# Altium schematic sheet Supply.SchDoc
size A4
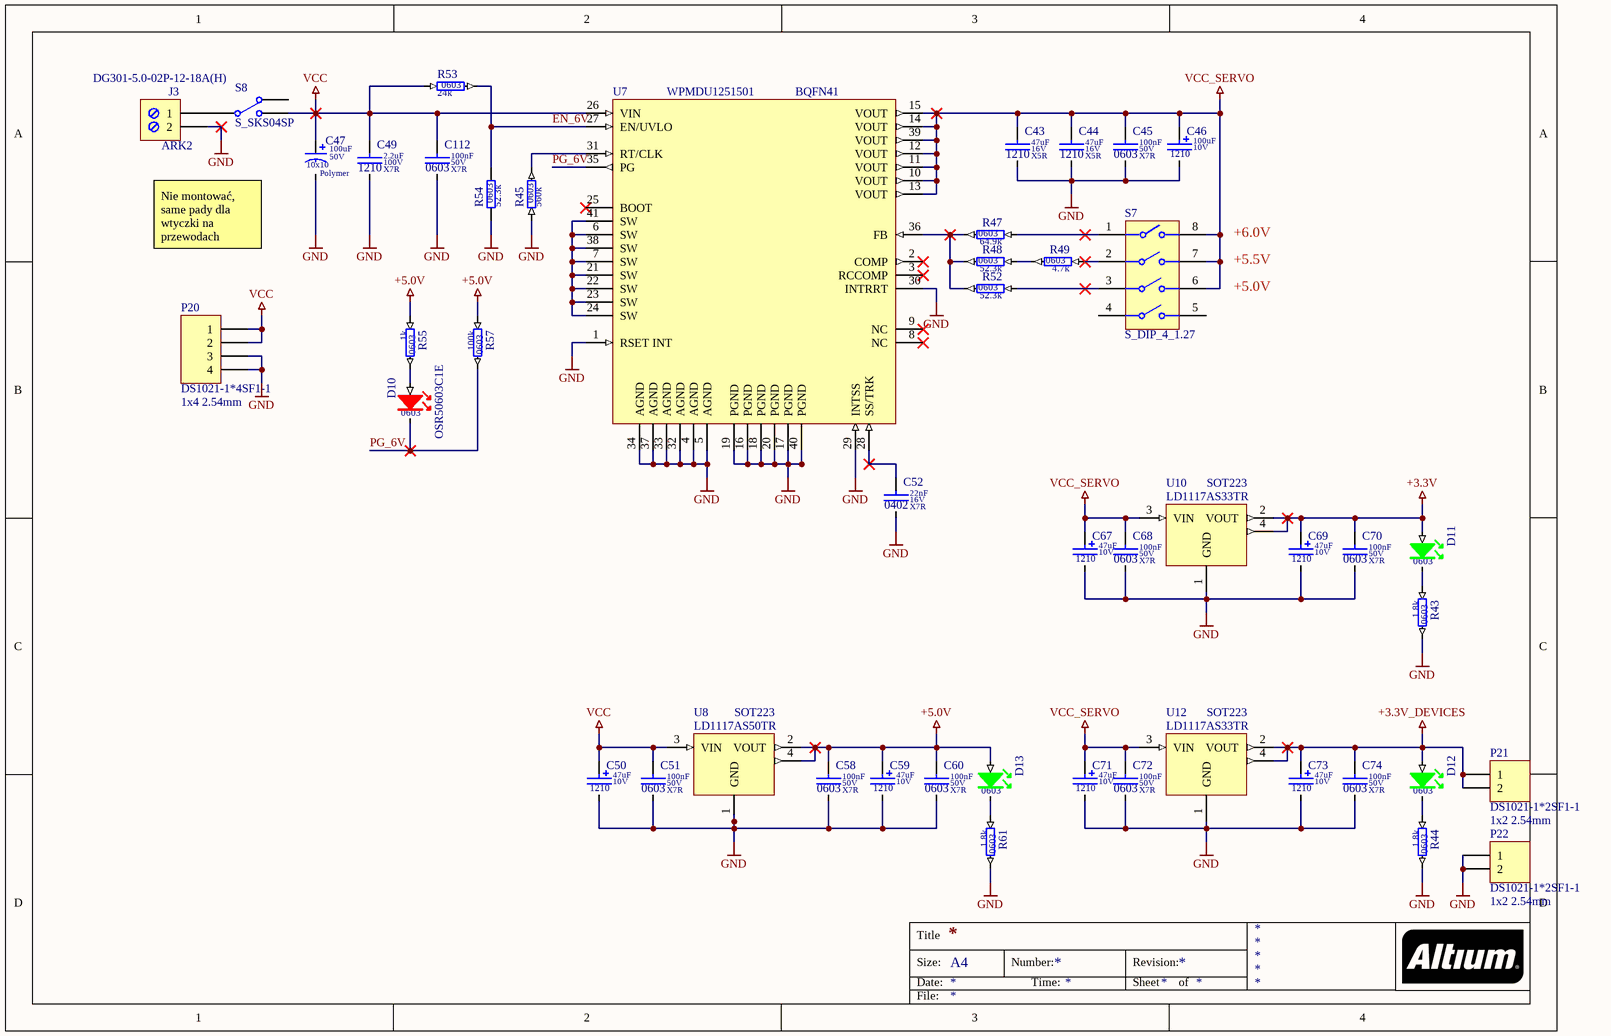
[diagram p0: Supply.SchDoc]

## Parts
C43  value 47uF  Dielectric: X5R  Voltage: 16V  SCH_Footprint: 1210  [C_1210_3225]  (hidden comment: Ceramic X5R)
C44  value 47uF  Dielectric: X5R  Voltage: 16V  SCH_Footprint: 1210  [C_1210_3225]  (hidden comment: Ceramic X5R)
C45  value 100nF  Dielectric: X7R  Voltage: 50V  SCH_Footprint: 0603  [C_0603_1608]  (hidden comment: Ceramic X7R)
C46  value 100uF  SCH_Footprint: 1210  Voltage: 10V  [CT_1210_3225]  (hidden comment: Tantalum Capacitor)
C47  value 100uF  Dielectric: Polymer  SCH_Footprint: 10x10  Voltage: 50V  [CE_D_10x10MM]  (hidden comment: Electrolytic Capacitor)
C49  value 2.2uF  Dielectric: X7R  Voltage: 100V  SCH_Footprint: 1210  [C_1210_3225]  (hidden comment: Ceramic X7R)
C50  value 47uF  SCH_Footprint: 1210  Voltage: 10V  [CT_1210_3225]  (hidden comment: Tantalum Capacitor)
C51  value 100nF  Dielectric: X7R  Voltage: 50V  SCH_Footprint: 0603  [C_0603_1608]  (hidden comment: Ceramic X7R)
C52  value 22nF  Dielectric: X7R  Voltage: 16V  SCH_Footprint: 0402  [C_0402_1005]  (hidden comment: Ceramic X7R)
C58  value 100nF  Dielectric: X7R  Voltage: 50V  SCH_Footprint: 0603  [C_0603_1608]  (hidden comment: Ceramic X7R)
C59  value 47uF  SCH_Footprint: 1210  Voltage: 10V  [CT_1210_3225]  (hidden comment: Tantalum Capacitor)
C60  value 100nF  Dielectric: X7R  Voltage: 50V  SCH_Footprint: 0603  [C_0603_1608]  (hidden comment: Ceramic X7R)
C67  value 47uF  SCH_Footprint: 1210  Voltage: 10V  [CT_1210_3225]  (hidden comment: Tantalum Capacitor)
C68  value 100nF  Dielectric: X7R  Voltage: 50V  SCH_Footprint: 0603  [C_0603_1608]  (hidden comment: Ceramic X7R)
C69  value 47uF  SCH_Footprint: 1210  Voltage: 10V  [CT_1210_3225]  (hidden comment: Tantalum Capacitor)
C70  value 100nF  Dielectric: X7R  Voltage: 50V  SCH_Footprint: 0603  [C_0603_1608]  (hidden comment: Ceramic X7R)
C71  value 47uF  SCH_Footprint: 1210  Voltage: 10V  [CT_1210_3225]  (hidden comment: Tantalum Capacitor)
C72  value 100nF  Dielectric: X7R  Voltage: 50V  SCH_Footprint: 0603  [C_0603_1608]  (hidden comment: Ceramic X7R)
C73  value 47uF  SCH_Footprint: 1210  Voltage: 10V  [CT_1210_3225]  (hidden comment: Tantalum Capacitor)
C74  value 100nF  Dielectric: X7R  Voltage: 50V  SCH_Footprint: 0603  [C_0603_1608]  (hidden comment: Ceramic X7R)
C112  value 100nF  Dielectric: X7R  Voltage: 50V  SCH_Footprint: 0603  [C_0603_1608]  (hidden comment: Ceramic X7R)
D10  value OSR50603C1E  SCH_Footprint: 0603  [OL_0603_1608]  (hidden comment: Red led)
D11  SCH_Footprint: 0603  [OL_0603_1608]  (hidden comment: OL_G)
D12  SCH_Footprint: 0603  [OL_0603_1608]  (hidden comment: OL_G)
D13  SCH_Footprint: 0603  [OL_0603_1608]  (hidden comment: OL_G)
J3  value DG301-5.0-02P-12-18A(H)  [J_ARK2]  (hidden comment: ARK2)
P20  value DS1021-1*4SF1-1  SCH_Footprint: 1x4 2.54mm  [P_HEADER_1x4_2.54]  (hidden comment: Goldpin)
P21  value DS1021-1*2SF1-1  SCH_Footprint: 1x2 2.54mm  [P_HEADER_1x2_2.54]  (hidden comment: Goldpin)
P22  value DS1021-1*2SF1-1  SCH_Footprint: 1x2 2.54mm  [P_HEADER_1x2_2.54]  (hidden comment: Goldpin)
R43  value 1.8k  SCH_Footprint: 0603  [R_0603_1608]  (hidden comment: Resistor)
R44  value 1.8k  SCH_Footprint: 0603  [R_0603_1608]  (hidden comment: Resistor)
R45  value 560k  SCH_Footprint: 0603  [R_0603_1608]  (hidden comment: Resistor)
R47  value 64.9k  SCH_Footprint: 0603  [R_0603_1608]  (hidden comment: Resistor)
R48  value 52.3k  SCH_Footprint: 0603  [R_0603_1608]  (hidden comment: Resistor)
R49  value 4.7k  SCH_Footprint: 0603  [R_0603_1608]  (hidden comment: Resistor)
R52  value 52.3k  SCH_Footprint: 0603  [R_0603_1608]  (hidden comment: Resistor)
R53  value 24k  SCH_Footprint: 0603  [R_0603_1608]  (hidden comment: Resistor)
R54  value 52.3k  SCH_Footprint: 0603  [R_0603_1608]  (hidden comment: Resistor)
R55  value 1k  SCH_Footprint: 0603  [R_0603_1608]  (hidden comment: Resistor)
R57  value 100k  SCH_Footprint: 0603  [R_0603_1608]  (hidden comment: Resistor)
R61  value 1.8k  SCH_Footprint: 0603  [R_0603_1608]  (hidden comment: Resistor)
S7  DIP SWITCH 4 POS  [S_DIP_4_1.27]  (value not drawn)
S8  S_SKS04SP  [Switch_toggle]
U7  SCH_Footprint: BQFN41  [BQFN41_11x9]  (hidden comment: WPMDU1251501)
U8  SCH_Footprint: SOT223  [SOT223_SC73]  (hidden comment: LD1117AS50TR)
U10  SCH_Footprint: SOT223  [SOT223_SC73]  (hidden comment: LD1117AS33TR)
U12  SCH_Footprint: SOT223  [SOT223_SC73]  (hidden comment: LD1117AS33TR)

## Nets
+3.3V: C69.1 C70.1 D11.2(A) U10.2(VOUT) U10.4(VOUT)
+3.3V_DEVICES: C73.1 C74.1 D12.2(A) P21.1 P21.2 U12.2(VOUT) U12.4(VOUT)
+5.0V: C58.1 C59.1 C60.1 D13.2(A) R55.1 R57.1 U8.2(VOUT) U8.4(VOUT)
GND: C43.2 C44.2 C45.2 C46.2 C47.2 C49.2 C50.2 C51.2 C52.2 C58.2 C59.2 C60.2 C67.2 C68.2 C69.2 C70.2 C71.2 C72.2 C73.2 C74.2 C112.2 J3.2 P20.3 P20.4 P22.1 P22.2 R43.2 R44.2 R45.1 R54.1 R61.2 U7.1(RSET_INT) U7.4(AGND) U7.5(AGND) U7.16(PGND) U7.17(PGND) U7.18(PGND) U7.19(PGND) U7.20(PGND) U7.29(INTSS) U7.30(INTRRT) U7.32(AGND) U7.33(AGND) U7.34(AGND) U7.37(AGND) U7.40(PGND) U8.1(GND) U10.1(GND) U12.1(GND)
VCC: C47.1 C49.1 C50.1 C51.1 C112.1 P20.1 P20.2 R53.1 S8.3(NO) U7.26(VIN) U8.3(VIN)
VCC_SERVO: C43.1 C44.1 C45.1 C46.1 C67.1 C68.1 C71.1 C72.1 S7.6 S7.7 S7.8 U7.10(VOUT) U7.11(VOUT) U7.12(VOUT) U7.13(VOUT) U7.14(VOUT) U7.15(VOUT) U7.39(VOUT) U10.3(VIN) U12.3(VIN)
EN_6V: R53.2 R54.2 U7.27(EN/UVLO)
PG_6V: D10.1(K) R57.2 U7.35(PG)
NetC52_1: C52.1 U7.28(SS/TRK)
NetD10_2: D10.2(A) R55.2
NetD11_1: D11.1(K) R43.1
NetD12_1: D12.1(K) R44.1
NetD13_1: D13.1(K) R61.1
NetJ3_1: J3.1 S8.2(COMMON)
NetR45_2: R45.2 U7.31(RT/CLK)
NetR47_1: R47.1 S7.1
NetR47_2: R47.2 R48.2 R52.2 U7.36(FB)
NetR48_1: R48.1 R49.2
NetR49_1: R49.1 S7.2
NetR52_1: R52.1 S7.3
NetU7_6: U7.6(SW) U7.7(SW) U7.21(SW) U7.22(SW) U7.23(SW) U7.24(SW) U7.38(SW) U7.41(SW)

Not connected (* = marked no-connect by the designer): S7 4 5; S8 1(NO); U7 2(COMP)* 3(RCCOMP)* 8(NC)* 9(NC)* 25(BOOT)*

## Notes on the sheet
- Nie montować, same pady dla wtyczki na przewodach
- +6.0V
- +5.5V
- +5.0V
- Title
- Size:
- Date:
- A4
- Number:
- Time:
- Revision:
- Sheet
- of
- File:

## Library data of the parts
C43 C44 = C_47uF_16V_X5R_1210_10: Capacitor; Manufacturer: Samsung; Manufacturer Part Number: CL32A476KOJNNNE; Tolerance (%): 10; Part Number: C_47uF_16V_X5R_1210_10; HelpURL: http://www.samsungsem.com/kr/support/product-search/mlcc/__icsFiles/afieldfile/2018/06/21/CL32A476KOJNNNE.pdf; Supplier 1: TME; Supplier 2: RS Components; Supplier 3: Farnell; Supplier 4: Mouser; Supplier 5: Digi-Key; Supplier Part Number 5: 1276-3376-1-ND
C45 C51 C58 C60 C68 C70 C72 C74 C112 = C_100nF_50V_X7R_0603_5: Capacitor; Manufacturer: Samsung; Manufacturer Part Number: CL10B104JB8NNNC; Tolerance (%): 5; Part Number: C_100nF_50V_X7R_0603_5; HelpURL: http://www.tme.eu/pl/Document/4a42202b32dab16128fe107dd69598cc/samsung-chip-cap.pdf; Supplier 1: TME; Supplier Part Number 1: CL10B104JB8NNNC; Supplier 2: RS Components; Supplier 3: Farnell; Supplier 4: Mouser; Supplier 5: Digi-Key
C46 C50 C59 C67 C69 C71 C73 = CT_100uF_10V_TA2O5_1210_20: Capacitor; Manufacturer: AVX; Manufacturer Part Number: TAJB107M010RNJ; Dielectric: TA2O5; Tolerance (%): 20; Part Number: CT_100uF_10V_TA2O5_1210_20; HelpURL: https://datasheet.octopart.com/TAJB107M010RNJ-AVX-datasheet-12511273.pdf; Supplier 1: TME; Supplier Part Number 1: TAJB107M010R; Supplier 2: RS Components; Supplier Part Number 2: 1360118; Supplier 3: Farnell; Supplier Part Number 3: 1658150; Supplier 4: Mouser; Supplier Part Number 4: 581-TAJB107M010R; Supplier 5: Digi-Key; Supplier Part Number 5: 478-5801-1-ND
C47 = CE_100uF_50V_Polymer_10x10_20: Polarized Capacitor; Manufacturer: Nichicon; Manufacturer Part Number: UUX1H101MNL1GS; Tolerance (%): 20; Part Number: CE_100uF_50V_Polymer_10x10_20; HelpURL: https://datasheet.octopart.com/UUX1H101MNL1GS-Nichicon-datasheet-62047998.pdf; Supplier 1: TME; Supplier Part Number 1: UUX1H101MNL1GS; Supplier 2: RS Components; Supplier Part Number 2: 739-3107; Supplier 3: Farnell; Supplier Part Number 3: 2841943; Supplier 4: Mouser; Supplier Part Number 4: 647-UUX1H101MNL1GS; Supplier 5: Digi-Key; Supplier Part Number 5: 493-6269-1-ND
C49 = C_2.2uF_100V_X7R_1210_10: Capacitor; Manufacturer: Samsung; Manufacturer Part Number: CL32B225KCJSNNE; Tolerance (%): 10; Part Number: C_2.2uF_100V_X7R_1210_10; HelpURL: http://datasheet.octopart.com/CL32B225KCJSNNE-Samsung-datasheet-37081328.pdf; Supplier 1: TME; Supplier Part Number 1: CL32B225KCJSNNE; Supplier 2: RS Components; Supplier Part Number 2: 7661211P; Supplier 3: Farnell; Supplier 4: Mouser; Supplier 5: Digi-Key; Supplier Part Number 5: 1276-3362-1-ND
C52 = C_22nF_16V_X7R_0402_10: Capacitor; Manufacturer: AVX; Manufacturer Part Number: 0402YC223KAT2A; Tolerance (%): 10; Part Number: C_22nF_16V_X7R_0402_10; HelpURL: http://datasheet.octopart.com/0402YC223KAT2A-AVX-datasheet-78690206.pdf; Supplier 1: TME; Supplier Part Number 1: 0402YC223KAT2A; Supplier 2: RS Components; Supplier Part Number 2: 6983188; Supplier 3: Farnell; Supplier Part Number 3: 2280808; Supplier 4: Mouser; Supplier Part Number 4: 581-0402YC223K; Supplier 5: Digi-Key; Supplier Part Number 5: 478-1118-1-ND
D10 = OL_R_0603_OSR50603C1E: LED_RED; Manufacturer: Optosupply; Part Number: OL_R_0603_OSR50603C1E; Manufacturer Part Number: OSR50603C1E; Supplier 1: TME; Supplier Part Number 1: OSR50603C1E; Supplier 2: RS Components; Supplier 3: Farnell; Supplier 4: Mouser; Supplier 5: Digi-Key
D11-D13 = OL_G_0603_0C06_APG1608CGKC/T: LED GREEN; Part Number: OL_G_0603_0C06_APG1608CGKC/T; Supplier 1: TME; Supplier 2: RS Components; Supplier 3: Farnell; Supplier 4: Mouser; Supplier 5: Digi-Key; Supplier Part Number 5: 754-1357-1-ND
J3 = J_TB-5.0-P-2P: ARK Screw terminal, 2-Pin; Manufacturer: DEGSON ELECTRONICS; SCH_Footprint: ARK2; Part Number: J_TB-5.0-P-2P; Component Type: Standard; HelpURL: https://datasheet.octopart.com/DG301-5.0-03P-12-18A%28H%29-Degson-datasheet-17801202.pdf; Manufacturer Part Number: DG301-5.0-02P-12-18A(H); Supplier 1: TME; Supplier Part Number 1: DG301-5.0-2/6B; Supplier 2: RS Components; Supplier 3: Farnell; Supplier 4: Mouser; Supplier 5: Digi-Key
P20 = P_HEADER_1x4_2.54: Header, 4-Pin; Manufacturer: Connfly; Part Number: P_HEADER_1x4_2.54; Component Type: Standard; HelpURL: http://datasheet.octopart.com/DS1021-1%2A4SF1-1-Connfly-datasheet-65537859.pdf; Manufacturer Part Number: DS1021-1*4SF1-1; Supplier 1: TME; Supplier Part Number 1: ZL201-04G; Supplier 2: RS Components; Supplier 3: Farnell; Supplier 4: Mouser; Supplier 5: Digi-Key
P21 P22 = P_HEADER_1x2_2.54: Header, 2-Pin; Manufacturer: Connfly; Part Number: P_HEADER_1x2_2.54; Component Type: Standard; HelpURL: http://www.tme.eu/en/Document/cc301e58a5da78cb543a94b5a5b7f06a/DS1021.pdf; Manufacturer Part Number: DS1021-1*2SF1-1; Supplier 1: TME; Supplier Part Number 1: ZL201-02G; Supplier 2: RS Components; Supplier 3: Farnell; Supplier 4: Mouser; Supplier 5: Digi-Key
R43 R44 R61 = R_1.8k_0603_1: Manufacturer: Vishay; Manufacturer Part Number: CRCW06031K80FKTABC; Voltage: 75V; Power: 100mW; Tolerance: 1%; Part Number: R_1.8k_0603_1; HelpURL: https://www.tme.eu/pl/Document/622e28308c06d160637f2b14751ba16b/Data%20Sheet%20CRCW_BCe3.pdf; Supplier 1: TME; Supplier Part Number 1: CRCW06031K80FKTABC; Supplier 2: RS Components; Supplier 3: Farnell; Supplier 4: Mouser; Supplier 5: Digi-Key
R45 = R_560k_0603_0.1: Manufacturer: TE Connectivity; Manufacturer Part Number: CPF0603B560KE1; Voltage: 50V; Power: 100mW; Tolerance: 0.1%; Part Number: R_560k_0603_0.1; HelpURL: https://datasheet.octopart.com/CPF0603B560KE1-Tyco-Electronics-datasheet-11120060.pdf; Supplier 1: TME; Supplier 2: RS Components; Supplier 3: Farnell; Supplier Part Number 3: 2331278; Supplier 4: Mouser; Supplier Part Number 4: 279-CPF0603B560KE1; Supplier 5: Digi-Key; Supplier Part Number 5: A102294CT-ND
R47 = R_64.9k_0603_1: Manufacturer: Panasonic; Manufacturer Part Number: ERJ-3EKF6492V; Voltage: 75V; Power: 100mW; Tolerance: 1%; Part Number: R_64.9k_0603_1; HelpURL: https://industrial.panasonic.com/cdbs/www-data/pdf/RDA0000/AOA0000C304.pdf; Supplier 1: TME; Supplier 2: RS Components; Supplier Part Number 2: 1229382; Supplier 3: Farnell; Supplier Part Number 3: 2059481; Supplier 4: Mouser; Supplier Part Number 4: 667-ERJ-3EKF6492V; Supplier 5: Digi-Key; Supplier Part Number 5: P64.9KHCT-ND
R48 R52 R54 = R_52.3k_0603_1: Manufacturer: Yageo; Manufacturer Part Number: RC0603FR-0752K3L; Voltage: 75V; Power: 100mW; Tolerance: 1%; Part Number: R_52.3k_0603_1; HelpURL: http://www.yageo.com/documents/recent/PYu-RC_Group_51_RoHS_L_9.pdf; Supplier 1: TME; Supplier 2: RS Components; Supplier 3: Farnell; Supplier 4: Mouser; Supplier Part Number 4: 603-RC0603FR-0752K3L; Supplier 5: Digi-Key; Supplier Part Number 5: 311-52.3KHRDKR-ND
R49 = R_4.7k_0603_1: Manufacturer: Yageo; Manufacturer Part Number: RC0603FR-074K7L; Voltage: 75V; Power: 100mW; Tolerance: 1%; Part Number: R_4.7k_0603_1; HelpURL: http://www.farnell.com/datasheets/2167052.pdf?_ga=2.156163131.1690599162.1548417389-1379097396.1542296996&_gac=1.18389067.1547230258.Cj0KCQiAmuHhBRD0ARIsAFWyPwhX8HcvXnM3tA0ZBodZLzDIjH2ZxLpjT5LWo9bad_HPRbU8LfPq44UaAhEwEALw_wcB; Supplier 1: TME; Supplier Part Number 1: RC0603FR-074K7; Supplier 2: RS Components; Supplier 3: Farnell; Supplier Part Number 3: 9238565; Supplier 4: Mouser; Supplier Part Number 4: 603-RC0603FR-074K7L; Supplier 5: Digi-Key; Supplier Part Number 5: 311-4.70KHRCT-ND
R53 = R_24k_0603_1: Manufacturer: Vishay; Manufacturer Part Number: CRCW060324K0FKTABC; Voltage: 75V; Power: 100mW; Tolerance: 1%; Part Number: R_24k_0603_1; HelpURL: http://www.tme.eu/pl/Document/622e28308c06d160637f2b14751ba16b/Data%20Sheet%20CRCW_BCe3.pdf; Supplier 1: TME; Supplier Part Number 1: CRCW060324K0FKTABC; Supplier 2: RS Components; Supplier 3: Farnell; Supplier 4: Mouser; Supplier 5: Digi-Key
R55 = R_1k_0603_1: Manufacturer: Vishay; Manufacturer Part Number: CRCW06031K00FKEA; Voltage: 75V; Power: 100mW; Tolerance: 1%; Part Number: R_1k_0603_1; HelpURL: http://www.farnell.com/datasheets/2310790.pdf?_ga=2.256888843.1690599162.1548417389-1379097396.1542296996&_gac=1.262631934.1547230258.Cj0KCQiAmuHhBRD0ARIsAFWyPwhX8HcvXnM3tA0ZBodZLzDIjH2ZxLpjT5LWo9bad_HPRbU8LfPq44UaAhEwEALw_wcB; Supplier 1: TME; Supplier 2: RS Components; Supplier Part Number 2: 678-9875P; Supplier 3: Farnell; Supplier Part Number 3: 1469740; Supplier 4: Mouser; Supplier Part Number 4: 71-CRCW0603-1.0K-E3; Supplier 5: Digi-Key; Supplier Part Number 5: 541-1.00KHCT-ND
R57 = R_100k_0603_1: Manufacturer: Royalohm; Manufacturer Part Number: 0603SAF1003T5E; Voltage: 50V; Power: 100mW; Tolerance: 1%; Part Number: R_100k_0603_1; HelpURL: http://www.tme.eu/pl/Document/b315665a56acbc42df513c99b390ad98/ROYALOHM-THICKFILM.pdf; Supplier 1: TME; Supplier Part Number 1: SMD0603-100K-1%; Supplier 2: RS Components; Supplier 3: Farnell; Supplier 4: Mouser; Supplier Part Number 4: 667-ERJ-3EKF1003V; Supplier 5: Digi-Key; Supplier Part Number 5: P100KHCT-ND
S7 = S_A6H-4101: Manufacturer: OMRON; Part Number: S_A6H-4101; SCH_Footprint: S_DIP_4_1.27; HelpURL: http://www.farnell.com/datasheets/2085437.pdf?_ga=2.8950133.1711911076.1544805648-547095826.1543447744; Manufacturer Part Number: A6H-4101; Supplier 1: TME; Supplier Part Number 1: A6H-4101; Supplier 2: RS Components; Supplier Part Number 2: 6866890; Supplier 3: Farnell; Supplier Part Number 3: 8774269; Supplier 4: Mouser; Supplier Part Number 4: 653-A6H-4101; Supplier 5: Digi-Key; Supplier Part Number 5: SW1080-ND
U7 = VS_WPMDU1251501: Manufacturer: Wurth; Frequency (kHz): 1000; Topology: Buck; Vin min (V): 7; Vin max (V): 50; Vout min (V): 2,5; Vout max (V): 15; Iswitch (A): 0; Part Number: VS_WPMDU1251501; Value: WPMDU1251501; Imax (A): 2,5; HelpURL: https://katalog.we-online.de/pm/datasheet/171021501.pdf; Manufacturer Part Number: WPMDU1251501; Supplier 1: TME; Supplier 2: RS Components; Supplier 3: Farnell; Supplier 4: Mouser; Supplier 5: Digi-Key; Supplier Part Number 5: 732-6217-1-ND
U8 U10 U12 = VL_LD1117AS33TR_3V3_1A2: Low-Dropout Positive Voltage Regulator; Manufacturer: STMicroelectronics; Voltage: 3.3V; Current: 1A2; Part Number: VL_LD1117AS33TR_3V3_1A2; HelpURL: http://www.tme.eu/pl/Document/bad00e7fc591b73ff810af309b2bb7a4/LD1117A.pdf; Supplier 1: TME; Supplier Part Number 1: LD1117AS33; Supplier 2: RS Components; Supplier 3: Farnell; Supplier Part Number 3: 1467776; Supplier 4: Mouser; Supplier Part Number 4: LD1117AS33; Supplier 5: Digi-Key; Supplier Part Number 5: 497-1228-1-ND
  U8: Value: LD1117AS50TR; Manufacturer Part Number: LD1117AS50TR
  U10 U12: Value: LD1117AS33TR; Manufacturer Part Number: LD1117AS33TR